# EAGLE board DSO_A_AFE_1.66c (EAGLE 7.7.0), part 1 of 2
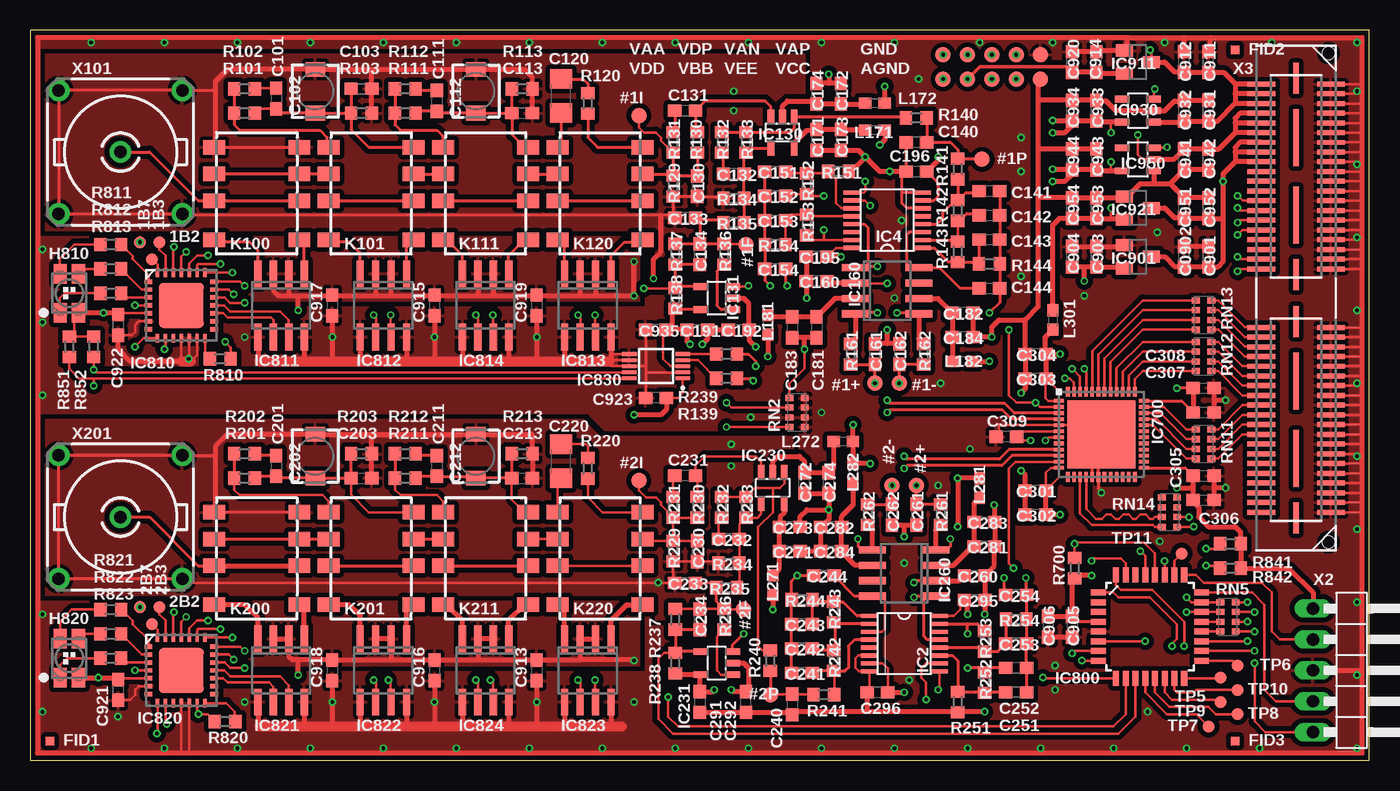
[diagram p4: board, top side]
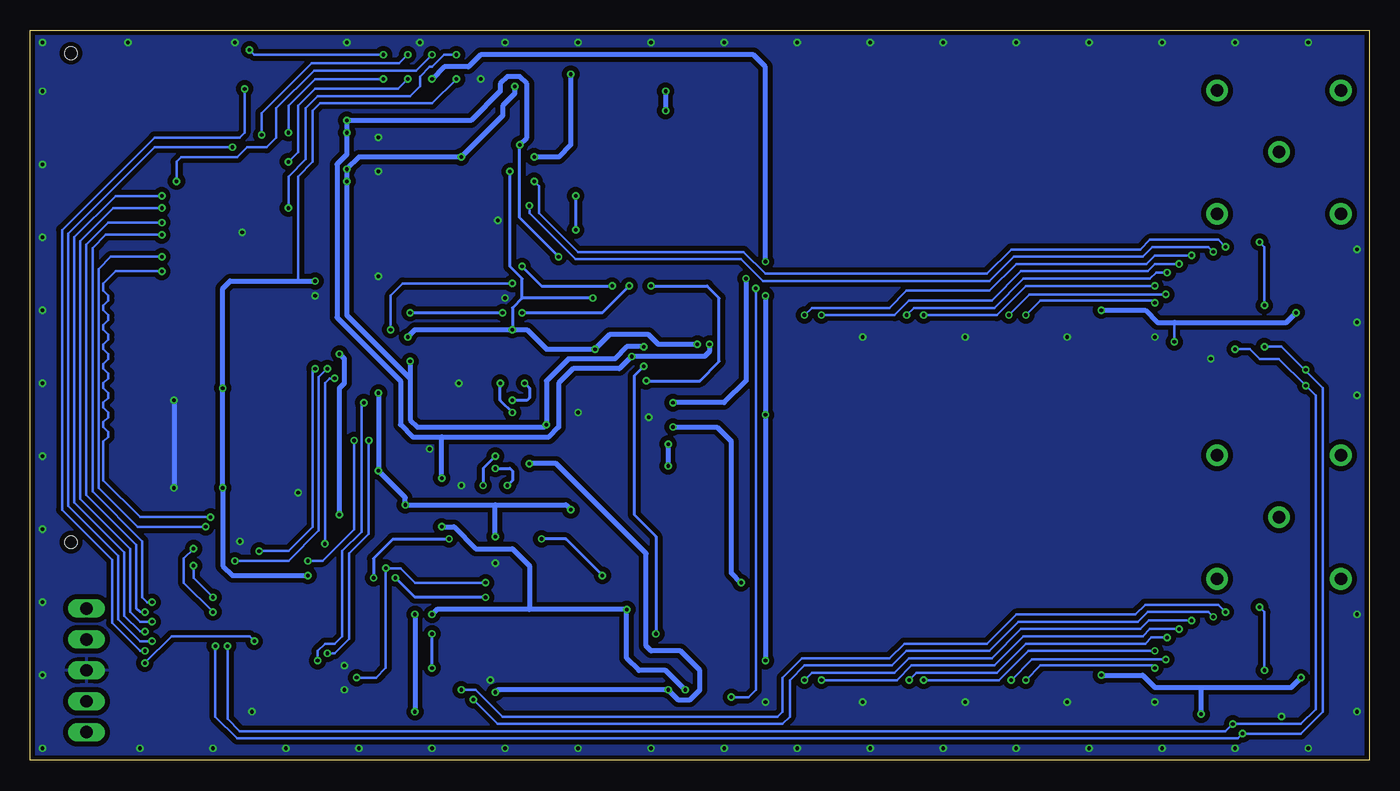
[diagram p5: board, bottom side, seen from below]

Size 110 x 60 mm. Coordinates in mm from the lower left corner, seen from the top.
Outline: 0,60 0,0 110,0 110,60 0,60
Copper layers (1*16): Top 0.035mm / dielectric 1.5mm / Bottom 0.035mm
Design rules "default *": minimum track width 5mil, minimum drill 0.3mm, track to track 5mil, track to pad 5mil, pad to pad 6mil, via to via 6mil, smd to smd 6mil, copper to edge 10mil, drill to drill 10mil, minimum pad ring 6mil, minimum via ring 6mil, stop-mask expansion 2mil, vias tented up to drill 0.6mm, thermal gap 12mil

## Footprints (pad centres in the part's own frame; a part is rotated, then mirrored left to right if it is on the bottom)
TP10R = smd 1 x 1: TP 0,0
B1,27 = smd 1.27 x 1.27: TP 0,0
C0603 = smd 1.1 x 1: 1 -0.85,0; 2 0.85,0
CTRIMTZBX4 = smd 1.6 x 1.2: 1 0,1.8; 2 0,-1.8
C1206 = smd 1.6 x 1.8: 1 -1.4,0; 2 1.4,0
TP07SQ = smd 0.7 x 0.7: TP 0,0
PLCC4_CREE = smd 1.1 x 1.6: 1 -0.75,-1.6; 2 0.75,-1.6; 3 0.75,1.6; 4 -0.75,1.6
TSSOP16 = smd 0.35 x 1.4: 1 -2.275,-2.875; 2 -1.625,-2.875; 3 -0.975,-2.875; 4 -0.325,-2.875; 5 0.325,-2.875; 6 0.975,-2.875; 7 1.625,-2.875; 8 2.275,-2.875; 9 2.275,2.875; 10 1.625,2.875; 11 0.975,2.875; 12 0.325,2.875; 13 -0.325,2.875; 14 -0.975,2.875; 15 -1.625,2.875; 16 -2.275,2.875
SOT23-5 = smd 0.55 x 1.2: 1 -0.95,-1.3; 2 0,-1.3; 3 0.95,-1.3; 4 0.95,1.3; 5 -0.95,1.3
SO8 = smd 0.6 x 2.2: 1 -1.905,-2.6; 2 -0.635,-2.6; 3 0.635,-2.6; 4 1.905,-2.6; 5 1.905,2.6; 6 0.635,2.6; 7 -0.635,2.6; 8 -1.905,2.6
TQFN48-EP = smd 0.3 x 0.8: 1 -2.75,-3.5; 2 -2.25,-3.5; 3 -1.75,-3.5; 4 -1.25,-3.5; 5 -0.75,-3.5; 6 -0.25,-3.5; 7 0.25,-3.5; 8 0.75,-3.5; 9 1.25,-3.5; 10 1.75,-3.5; 11 2.25,-3.5; 12 2.75,-3.5; 25 2.75,3.5; 26 2.25,3.5; 27 1.75,3.5; 28 1.25,3.5; 29 0.75,3.5; 30 0.25,3.5; 31 -0.25,3.5; 32 -0.75,3.5; 33 -1.25,3.5; 34 -1.75,3.5; 35 -2.25,3.5; 36 -2.75,3.5 | smd 0.8 x 0.3: 13 3.5,-2.75; 14 3.5,-2.25; 15 3.5,-1.75; 16 3.5,-1.25; 17 3.5,-0.75; 18 3.5,-0.25; 19 3.5,0.25; 20 3.5,0.75; 21 3.5,1.25; 22 3.5,1.75; 23 3.5,2.25; 24 3.5,2.75; 37 -3.5,2.75; 38 -3.5,2.25; 39 -3.5,1.75; 40 -3.5,1.25; 41 -3.5,0.75; 42 -3.5,0.25; 43 -3.5,-0.25; 44 -3.5,-0.75; 45 -3.5,-1.25; 46 -3.5,-1.75; 47 -3.5,-2.25; 48 -3.5,-2.75 | smd 5.6 x 5.6: EXP 0,0
LQFP32_7X7 = smd 1.2 x 0.5: 1 -4.25,2.8; 2 -4.25,2; 3 -4.25,1.2; 4 -4.25,0.4; 5 -4.25,-0.4; 6 -4.25,-1.2; 7 -4.25,-2; 8 -4.25,-2.8; 17 4.25,-2.8; 18 4.25,-2; 19 4.25,-1.2; 20 4.25,-0.4; 21 4.25,0.4; 22 4.25,1.2; 23 4.25,2; 24 4.25,2.8 | smd 0.5 x 1.2: 9 -2.8,-4.25; 10 -2,-4.25; 11 -1.2,-4.25; 12 -0.4,-4.25; 13 0.4,-4.25; 14 1.2,-4.25; 15 2,-4.25; 16 2.8,-4.25; 25 2.8,4.25; 26 2,4.25; 27 1.2,4.25; 28 0.4,4.25; 29 -0.4,4.25; 30 -1.2,4.25; 31 -2,4.25; 32 -2.8,4.25
QFN28-ML_6X6MM = smd 0.7 x 0.35: 1 -2.7,1.95; 2 -2.7,1.3; 3 -2.7,0.65; 4 -2.7,0; 5 -2.7,-0.65; 6 -2.7,-1.3; 7 -2.7,-1.95; 15 2.7,-1.95; 16 2.7,-1.3; 17 2.7,-0.65; 18 2.7,0; 19 2.7,0.65; 20 2.7,1.3; 21 2.7,1.95 | smd 0.35 x 0.7: 8 -1.95,-2.7; 9 -1.3,-2.7; 10 -0.65,-2.7; 11 0,-2.7; 12 0.65,-2.7; 13 1.3,-2.7; 14 1.95,-2.7; 22 1.95,2.7; 23 1.3,2.7; 24 0.65,2.7; 25 0,2.7; 26 -0.65,2.7; 27 -1.3,2.7; 28 -1.95,2.7 | smd 3.7 x 3.7: EXP 0,0
SO08 = smd 0.6 x 2.2: 1 -1.905,-2.6; 2 -0.635,-2.6; 3 0.635,-2.6; 4 1.905,-2.6; 5 1.905,2.6; 6 0.635,2.6; 7 -0.635,2.6; 8 -1.905,2.6
MSOP10 = smd 0.3 x 1.2: 1 -1,-2.2; 2 -0.5,-2.2; 3 0,-2.2; 4 0.5,-2.2; 5 1,-2.2; 6 1,2.2; 7 0.5,2.2; 8 0,2.2; 9 -0.5,2.2; 10 -1,2.2
SOT23 = smd 1 x 1.4: 1 -0.95,-1.1; 2 0.95,-1.1; 3 0,1.1
SOT25 = smd 0.55 x 1.2: 1 -0.95,-1.3; 2 0,-1.3; 3 0.95,-1.3; 4 0.95,1.3; 5 -0.95,1.3
G6KU-2F-Y = smd 1.2 x 1.8: 1 -3.8,-3.5; 2 -0.6,-3.5; 3 1.6,-3.5; 4 3.8,-3.5; 5 3.8,3.5; 6 1.6,3.5; 7 -0.6,3.5; 8 -3.8,3.5
0603 = smd 1 x 0.9: 1 -0.8,0; 2 0.8,0
R0603 = smd 1 x 1.1: 1 -0.85,0; 2 0.85,0
0603-ARC = smd 0.5 x 0.65: 1 -1.2,-0.625; 2 -0.4,-0.625; 3 0.4,-0.625; 4 1.2,-0.625; 5 1.2,0.625; 6 0.4,0.625; 7 -0.4,0.625; 8 -1.2,0.625
1X05/90 = drill 1.016 long: 1 -5.08,-3.81; 2 -2.54,-3.81; 3 0,-3.81; 4 2.54,-3.81; 5 5.08,-3.81
QSE-040-02 = smd 0.41 x 2.27: 1 -17.595,-2.86; 2 -17.595,2.87; 3 -16.795,-2.86; 4 -16.795,2.87; 5 -15.995,-2.86; 6 -15.995,2.87; 7 -15.195,-2.86; 8 -15.195,2.87; 9 -14.395,-2.86; 10 -14.395,2.87; 11 -13.595,-2.86; 12 -13.595,2.87; 13 -12.795,-2.86; 14 -12.795,2.87; 15 -11.995,-2.86; 16 -11.995,2.87; 17 -11.195,-2.86; 18 -11.195,2.87; 19 -10.395,-2.86; 20 -10.395,2.87; 21 -9.595,-2.86; 22 -9.595,2.87; 23 -8.795,-2.86; 24 -8.795,2.87; 25 -7.995,-2.86; 26 -7.995,2.87; 27 -7.195,-2.86; 28 -7.195,2.87; 29 -6.395,-2.86; 30 -6.395,2.87; 31 -5.595,-2.86; 32 -5.595,2.87; 33 -4.795,-2.86; 34 -4.795,2.87; 35 -3.995,-2.86; 36 -3.995,2.87; 37 -3.195,-2.86; 38 -3.195,2.87; 39 -2.395,-2.86; 40 -2.395,2.87; 41 2.405,-2.86; 42 2.405,2.87; 43 3.205,-2.86; 44 3.205,2.87; 45 4.005,-2.86; 46 4.005,2.87; 47 4.805,-2.86; 48 4.805,2.87; 49 5.605,-2.86; 50 5.605,2.87; 51 6.405,-2.86; 52 6.405,2.87; 53 7.205,-2.86; 54 7.205,2.87; 55 8.005,-2.86; 56 8.005,2.87; 57 8.805,-2.86; 58 8.805,2.87; 59 9.605,-2.86; 60 9.605,2.87; 61 10.405,-2.86; 62 10.405,2.87; 63 11.205,-2.86; 64 11.205,2.87; 65 12.005,-2.86; 66 12.005,2.87; 67 12.805,-2.86; 68 12.805,2.87; 69 13.605,-2.86; 70 13.605,2.87; 71 14.405,-2.86; 72 14.405,2.87; 73 15.205,-2.86; 74 15.205,2.87; 75 16.005,-2.86; 76 16.005,2.87; 77 16.805,-2.86; 78 16.805,2.87; 79 17.605,-2.86; 80 17.605,2.87 | smd 2.54 x 0.43: M1 -18.065,0; M2 -1.935,0; M5 1.935,0; M6 18.065,0 | smd 4.7 x 0.43: M3 -13.175,0; M4 -6.825,0; M7 6.825,0; M8 13.175,0 | hole 1.02: -20.13,2.67; 20.065,2.67
A1944 = drill 1.016 pad 1.778: 1 0,0; 2 5.08,5.08; 3 -5.08,5.08; 4 -5.08,-5.08; 5 5.08,-5.08

## Placement (x,y rotation side)
1B2  TPSTP10R  [TP10R]  10.6,42.6 0 top
1B3  TPSTP10R  [TP10R]  10,41.2 0 top
1B7  TPSTP10R  [TP10R]  9,42.6 0 top
2B2  TPSTP10R  [TP10R]  10.6,12.6 0 top
2B3  TPSTP10R  [TP10R]  10,11.2 0 top
2B7  TPSTP10R  [TP10R]  9,12.6 0 top
#1+  TPB1,27  [B1,27]  69.4,31 0 top
#1-  TPB1,27  [B1,27]  71.4,31 0 top
#1F  TPB1,27  [B1,27]  58.8,42.4 90 top
#1I  TPB1,27  [B1,27]  50,53 180 top
#1P  TPB1,27  [B1,27]  78.2,49.4 90 top
#2+  TPB1,27  [B1,27]  72.8,22.6 0 top
#2-  TPB1,27  [B1,27]  70.8,22.6 0 top
#2F  TPB1,27  [B1,27]  58.6,12.4 90 top
#2I  TPB1,27  [B1,27]  50,23 180 top
#2P  TPB1,27  [B1,27]  60.8,5.4 0 top
AGND  TPB1,27  [B1,27]  83,56 0 top
C101  15p  [C0603]  20.2,54.4 270 top
C102  6.5-30p  [CTRIMTZBX4]  23.4,55 180 top
C103  100p  [C0603]  27.2,55.2 0 top
C111  15p  [C0603]  33.4,54.2 270 top
C112  6.5-30p  [CTRIMTZBX4]  36.6,55 180 top
C113  100p  [C0603]  40.4,53.2 0 top
C120  100n/100V  [C1206]  43.6,54.6 90 top
C130  1p  [C0603]  54.8,47.2 270 top
C131  10n  [C0603]  53.8,53.4 180 top
C132  1p  [C0603]  57.8,48.2 180 top
C133  4.7u  [C0603]  53.8,44.6 180 top
C134  47n  [C0603]  55,41.6 90 top
C140  DNP  [C0603]  72.8,50.8 180 top
C141  4.7p  [C0603]  78.8,46.8 0 top
C142  4.7p  [C0603]  78.8,44.8 0 top
C143  1p  [C0603]  78.8,42.8 0 top
C144  1p  [C0603]  78.8,38.8 0 top
C151  4.7p  [C0603]  61.2,48.4 0 top
C152  4.7p  [C0603]  61.2,46.4 0 top
C153  1p  [C0603]  61.2,44.4 0 top
C154  1p  [C0603]  61.2,40.4 0 top
C160  100n  [C0603]  64.6,39.4 180 top
C161  18p  [C0603]  69.4,33.4 90 top
C162  18p  [C0603]  71.4,33.4 270 top
C171  1u  [C0603]  64.6,51 270 top
C172  1u  [C0603]  66.6,54.8 270 top
C173  100n  [C0603]  66.6,51 270 top
C174  100n  [C0603]  64.6,54.8 270 top
C181  1u  [C0603]  64.6,35.6 270 top
C182  100n  [C0603]  76.6,36.8 180 top
C183  100n  [C0603]  62.6,35.6 270 top
C184  1u  [C0603]  76.6,34.8 180 top
C191  100n  [C0603]  54.8,35.4 0 top
C192  100n  [C0603]  58.2,35.4 0 top
C195  100n  [C0603]  64.6,41.4 180 top
C196  100n  [C0603]  72.8,48.4 0 top
C201  15p  [C0603]  20.2,24.2 270 top
C202  6.5-30p  [CTRIMTZBX4]  23.4,25 180 top
C203  100p  [C0603]  27.2,23.2 0 top
C211  15p  [C0603]  33.4,24.2 270 top
C212  6.5-30p  [CTRIMTZBX4]  36.6,25 180 top
C213  100p  [C0603]  40.4,23.2 0 top
C220  100n/100V  [C1206]  43.6,24.6 90 top
C230  1p  [C0603]  54.8,17.2 270 top
C231  10n  [C0603]  53.8,23.4 180 top
C232  1p  [C0603]  57.4,18.2 180 top
C233  4.7u  [C0603]  53.8,14.6 180 top
C234  47n  [C0603]  55,11.6 90 top
C240  DNP  [C0603]  62.6,4.6 270 top
C241  4.7p  [C0603]  63.4,7.2 180 top
C242  4.7p  [C0603]  63.4,9.2 180 top
C243  1p  [C0603]  63.4,11.2 180 top
C244  1p  [C0603]  65.2,15.2 180 top
C251  4.7p  [C0603]  81,5.6 180 top
C252  4.7p  [C0603]  81,7.6 180 top
C253  1p  [C0603]  81,9.6 180 top
C254  1p  [C0603]  81,13.6 180 top
C260  100n  [C0603]  77.6,15.2 0 top
C261  18p  [C0603]  72.8,20.2 270 top
C262  18p  [C0603]  70.8,20.2 90 top
C271  1u  [C0603]  62.4,17.2 0 top
C272  1u  [C0603]  63.6,22.8 90 top
C273  100n  [C0603]  62.4,19.2 0 top
C274  100n  [C0603]  65.6,22.8 90 top
C281  1u  [C0603]  78.4,17.6 0 top
C282  1u  [C0603]  65.8,19.2 0 top
C283  100n  [C0603]  78.4,19.6 0 top
C284  100n  [C0603]  65.8,17.2 0 top
C291  100n  [C0603]  55,4.8 270 top
C292  100n  [C0603]  58.8,4.8 90 top
C295  100n  [C0603]  77.6,13.2 0 top
C296  100n  [C0603]  69.6,5.6 0 top
C301  1u  [C0603]  82.6,22.2 180 top
C302  1u  [C0603]  82.6,20.2 180 top
C303  100n  [C0603]  82.6,31.4 180 top
C304  100n  [C0603]  82.6,33.4 180 top
C305  100n  [C0603]  96.4,23.4 0 top
C306  100n  [C0603]  96.4,21.4 0 top
C307  1u  [C0603]  96.4,28.6 0 top
C308  1u  [C0603]  96.4,30.6 0 top
C309  100n  [C0603]  80.2,26.6 180 top
C901  4.7u  [C0603]  96.8,41.4 90 top
C0902  100n  [C0603]  94.8,41.4 90 top
C903  100n  [C0603]  87.6,41.4 90 top
C904  4.7u  [C0603]  85.6,41.4 90 top
C905  4.7u  [C0603]  85.6,11 270 top
C906  100n  [C0603]  83.6,11 270 top
C911  4.7u  [C0603]  96.8,57.4 90 top
C912  100n  [C0603]  94.8,57.4 90 top
C913  100n  [C0603]  41.6,7.4 270 top
C914  4.7u  [C0603]  87.6,57.4 90 top
C915  1u  [C0603]  33.2,37.4 270 top
C916  1u  [C0603]  33.2,7.4 270 top
C917  1u  [C0603]  24.8,37.4 270 top
C918  1u  [C0603]  24.8,7.4 270 top
C919  1u  [C0603]  41.6,37.4 270 top
C920  1u  [C0603]  85.6,57.4 90 top
C921  1u  [C0603]  7.2,5.8 270 top
C922  1u  [C0603]  7.2,35.8 270 top
C923  100n  [C0603]  51.4,29.8 180 top
C931  4.7u  [C0603]  96.8,53.4 90 top
C932  100n  [C0603]  94.8,53.4 90 top
C933  100n  [C0603]  87.6,53.4 90 top
C934  4.7u  [C0603]  85.6,53.4 90 top
C935  100n  [C0603]  51.4,35.4 180 top
C941  4.7u  [C0603]  94.8,49.4 90 top
C942  100n  [C0603]  96.8,49.4 90 top
C943  100n  [C0603]  87.6,49.4 270 top
C944  4.7u  [C0603]  85.6,49.4 270 top
C951  4.7u  [C0603]  94.8,45.4 90 top
C952  100n  [C0603]  96.8,45.4 90 top
C953  100n  [C0603]  87.6,45.4 90 top
C954  4.7u  [C0603]  85.6,45.4 90 top
FID1  PTR1TP07SQ  [TP07SQ]  1.6,1.6 0 top
FID2  PTR1TP07SQ  [TP07SQ]  99,58.4 0 top
FID3  PTR1TP07SQ  [TP07SQ]  99,1.6 0 top
GND  TPB1,27  [B1,27]  83,58 0 top
H810  [PLCC4_CREE]  3.2,38.4 0 top
H820  [PLCC4_CREE]  3.2,8.4 0 top
IC2  [TSSOP16]  71.8,9.6 270 top
IC4  [TSSOP16]  70.4,44.4 90 top
IC130  AD8065RT  [SOT23-5]  61.8,51.6 180 top
IC131  MCP6H01  [SOT23-5]  56.4,38 90 top
IC160  AD8132  [SO8]  70.4,38.6 270 top
IC230  AD8065RT  [SOT23-5]  61,22.4 180 top
IC231  MCP6H01  [SOT23-5]  56.4,8 90 top
IC260  AD8132  [SO8]  71.8,15.4 90 top
IC700  MAX19516  [TQFN48-EP]  88,26.8 270 top
IC800  STM32G031K6T6  [LQFP32_7X7]  92,11 0 top
IC810  MCP23017ML  [QFN28-ML_6X6MM]  12.4,37.4 0 top
IC811  L9110  [SO08]  20.6,37.4 180 top
IC812  L9110  [SO08]  29,37.4 180 top
IC813  L9110  [SO08]  45.8,37.4 180 top
IC814  L9110  [SO08]  37.4,37.4 180 top
IC820  MCP23017ML  [QFN28-ML_6X6MM]  12.4,7.4 0 top
IC821  L9110  [SO08]  20.6,7.4 180 top
IC822  L9110  [SO08]  29,7.4 180 top
IC823  L9110  [SO08]  45.8,7.4 180 top
IC824  L9110  [SO08]  37.4,7.4 180 top
IC830  MCP47CVB02  [MSOP10]  51.4,32.4 90 top
IC901  MCP1500  [SOT23]  91,41.4 270 top
IC911  MCP1500T-5002E/TT  [SOT23]  91,57.4 270 top
IC921  MCP1500  [SOT23]  91,45.4 270 top
IC930  NCP718  [SOT25]  91,53.4 90 top
IC950  XC6901  [SOT25]  91,49.4 90 top
K100  G6KU-2F-Y  [G6KU-2F-Y]  18.6,46.6 90 top
K101  G6KU-2F-Y  [G6KU-2F-Y]  28,46.6 90 top
K111  G6KU-2F-Y  [G6KU-2F-Y]  37.4,46.6 90 top
K120  G6KU-2F-Y  [G6KU-2F-Y]  46.8,46.6 90 top
K200  G6KU-2F-Y  [G6KU-2F-Y]  18.6,16.6 90 top
K201  G6KU-2F-Y  [G6KU-2F-Y]  28,16.6 90 top
K211  G6KU-2F-Y  [G6KU-2F-Y]  37.4,16.6 90 top
K220  G6KU-2F-Y  [G6KU-2F-Y]  46.8,16.6 90 top
L171  [0603]  69.4,51.8 180 top
L172  [0603]  69.4,54 180 top
L181  [0603]  60.6,35.8 90 top
L182  [0603]  76.6,32.8 180 top
L271  [0603]  61,14.4 90 top
L272  [0603]  66.8,26.2 180 top
L281  [0603]  78,22.4 270 top
L282  [0603]  67.6,23.6 270 top
L301  [0603]  84,36.2 270 top
R101  910k  [R0603]  17.6,53.2 0 top
R102  0  [R0603]  17.6,55.2 0 top
R103  113k  [R0603]  27.2,53.2 0 top
R111  910k  [R0603]  30.8,53.2 0 top
R112  0  [R0603]  30.8,55.2 0 top
R113  113k  [R0603]  40.4,55.2 0 top
R120  220  [R0603]  45.8,54 90 top
R129  1M  [R0603]  52.8,47.2 270 top
R130  15k  [R0603]  54.8,50.8 90 top
R131  0  [R0603]  52.8,50.8 90 top
R132  0  [R0603]  56.8,50.8 90 top
R133  620  [R0603]  58.8,50.8 90 top
R134  499  [R0603]  57.8,46.2 0 top
R135  1k  [R0603]  57.8,44.2 180 top
R136  220  [R0603]  57,41.6 90 top
R137  499  [R0603]  53,41.6 90 top
R138  499  [R0603]  53,38 90 top
R139  220  [R0603]  57.2,31.4 0 top
R140  0  [R0603]  72.8,52.8 0 top
R141  100  [R0603]  76.2,48.6 90 top
R142  102  [R0603]  76.2,45.2 90 top
R143  102  [R0603]  76.2,41.8 90 top
R144  316  [R0603]  78.8,40.8 180 top
R151  100  [R0603]  66.4,48.4 180 top
R152  102  [R0603]  63.8,47.4 90 top
R153  102  [R0603]  63.8,44 270 top
R154  316  [R0603]  61.2,42.4 0 top
R161  62  [R0603]  67.4,33.4 270 top
R162  62  [R0603]  73.4,33.4 270 top
R201  910k  [R0603]  17.6,23.2 0 top
R202  0  [R0603]  17.6,25.2 0 top
R203  113k  [R0603]  27.2,25.2 0 top
R211  910k  [R0603]  30.8,23.2 0 top
R212  0  [R0603]  30.8,25.2 0 top
R213  113k  [R0603]  40.4,25.2 0 top
R220  220  [R0603]  45.8,24 270 top
R229  1M  [R0603]  52.8,17.2 270 top
R230  15k  [R0603]  54.8,20.8 90 top
R231  0  [R0603]  52.8,20.8 90 top
R232  0  [R0603]  56.8,20.8 90 top
R233  620  [R0603]  58.8,20.8 90 top
R234  499  [R0603]  57.4,16.2 0 top
R235  1k  [R0603]  57.2,14.2 180 top
R236  220  [R0603]  57,11.6 90 top
R237  499  [R0603]  53,11.6 90 top
R238  499  [R0603]  53,8 90 top
R239  220  [R0603]  57.2,33.4 0 top
R240  0  [R0603]  60.8,8.2 270 top
R241  100  [R0603]  65.2,5.4 180 top
R242  102  [R0603]  66,8.2 270 top
R243  102  [R0603]  66,12.2 270 top
R244  316  [R0603]  63.4,13.2 0 top
R251  100  [R0603]  76.2,4.8 90 top
R252  102  [R0603]  78.4,6.4 270 top
R253  102  [R0603]  78.4,9.8 90 top
R254  316  [R0603]  81,11.6 180 top
R261  62  [R0603]  74.8,20.2 90 top
R262  62  [R0603]  68.8,20.2 90 top
R700  499  [R0603]  85.8,15.8 90 top
R810  499  [R0603]  15.6,33 180 top
R811  499  [R0603]  6.6,42.4 0 top
R812  499  [R0603]  6.6,40.4 0 top
R813  499  [R0603]  6.6,38.4 0 top
R820  499  [R0603]  16,3.2 0 top
R821  499  [R0603]  6.6,12.4 0 top
R822  499  [R0603]  6.6,10.4 0 top
R823  499  [R0603]  6.6,8.4 0 top
R841  1k  [R0603]  98.6,17.8 0 top
R842  1k  [R0603]  98.6,15.8 0 top
R851  1k  [R0603]  3.2,34 90 top
R852  1k  [R0603]  5.2,34 90 top
RN2  [0603-ARC]  63,28.6 270 top
RN5  [0603-ARC]  98.4,11.8 90 top
RN11  [0603-ARC]  96.4,26 90 top
RN12  [0603-ARC]  96.4,33.2 90 top
RN13  [0603-ARC]  96.4,36.6 90 top
RN14  [0603-ARC]  93.6,20.4 90 top
TP5  TPSTP10R  [TP10R]  97.8,6.8 0 top
TP6  TPSTP10R  [TP10R]  99.2,7.8 0 top
TP7  TPSTP10R  [TP10R]  96.8,2.8 0 top
TP8  TPSTP10R  [TP10R]  99.2,3.8 0 top
TP9  TPSTP10R  [TP10R]  97.8,4.8 0 top
TP10  TPSTP10R  [TP10R]  99.2,5.8 0 top
TP11  TPSTP10R  [TP10R]  94.6,17 0 top
VAA  TPB1,27  [B1,27]  75,58 0 top
VAN  TPB1,27  [B1,27]  79,58 180 top
VAP  TPB1,27  [B1,27]  81,58 0 top
VBB  TPB1,27  [B1,27]  77,56 180 top
VCC  TPB1,27  [B1,27]  81,56 0 top
VDD  TPB1,27  [B1,27]  75,56 0 top
VDP  TPB1,27  [B1,27]  77,58 0 top
VEE  TPB1,27  [B1,27]  79,56 0 top
X2  [1X05/90]  109.2,7.4 270 top
X3  QSE-040-02  [QSE-040-02]  104,38 270 top
X101  A1944-50  [A1944]  7.4,50 0 top
X201  A1944-50  [A1944]  7.4,20 0 top